# Altium schematic sheet interface.SchDoc (part 1 of 2)
size A1; SheetNumber: 1; SheetTotal: 1
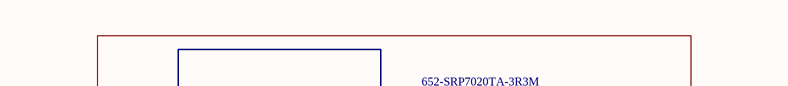
[diagram p0: interface.SchDoc, top left]
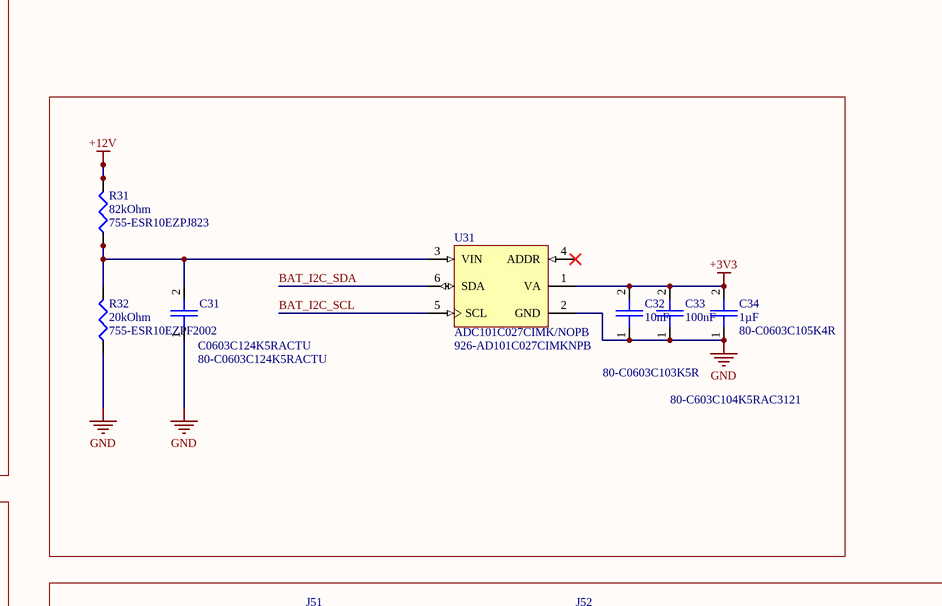
[diagram p1: interface.SchDoc, top right]
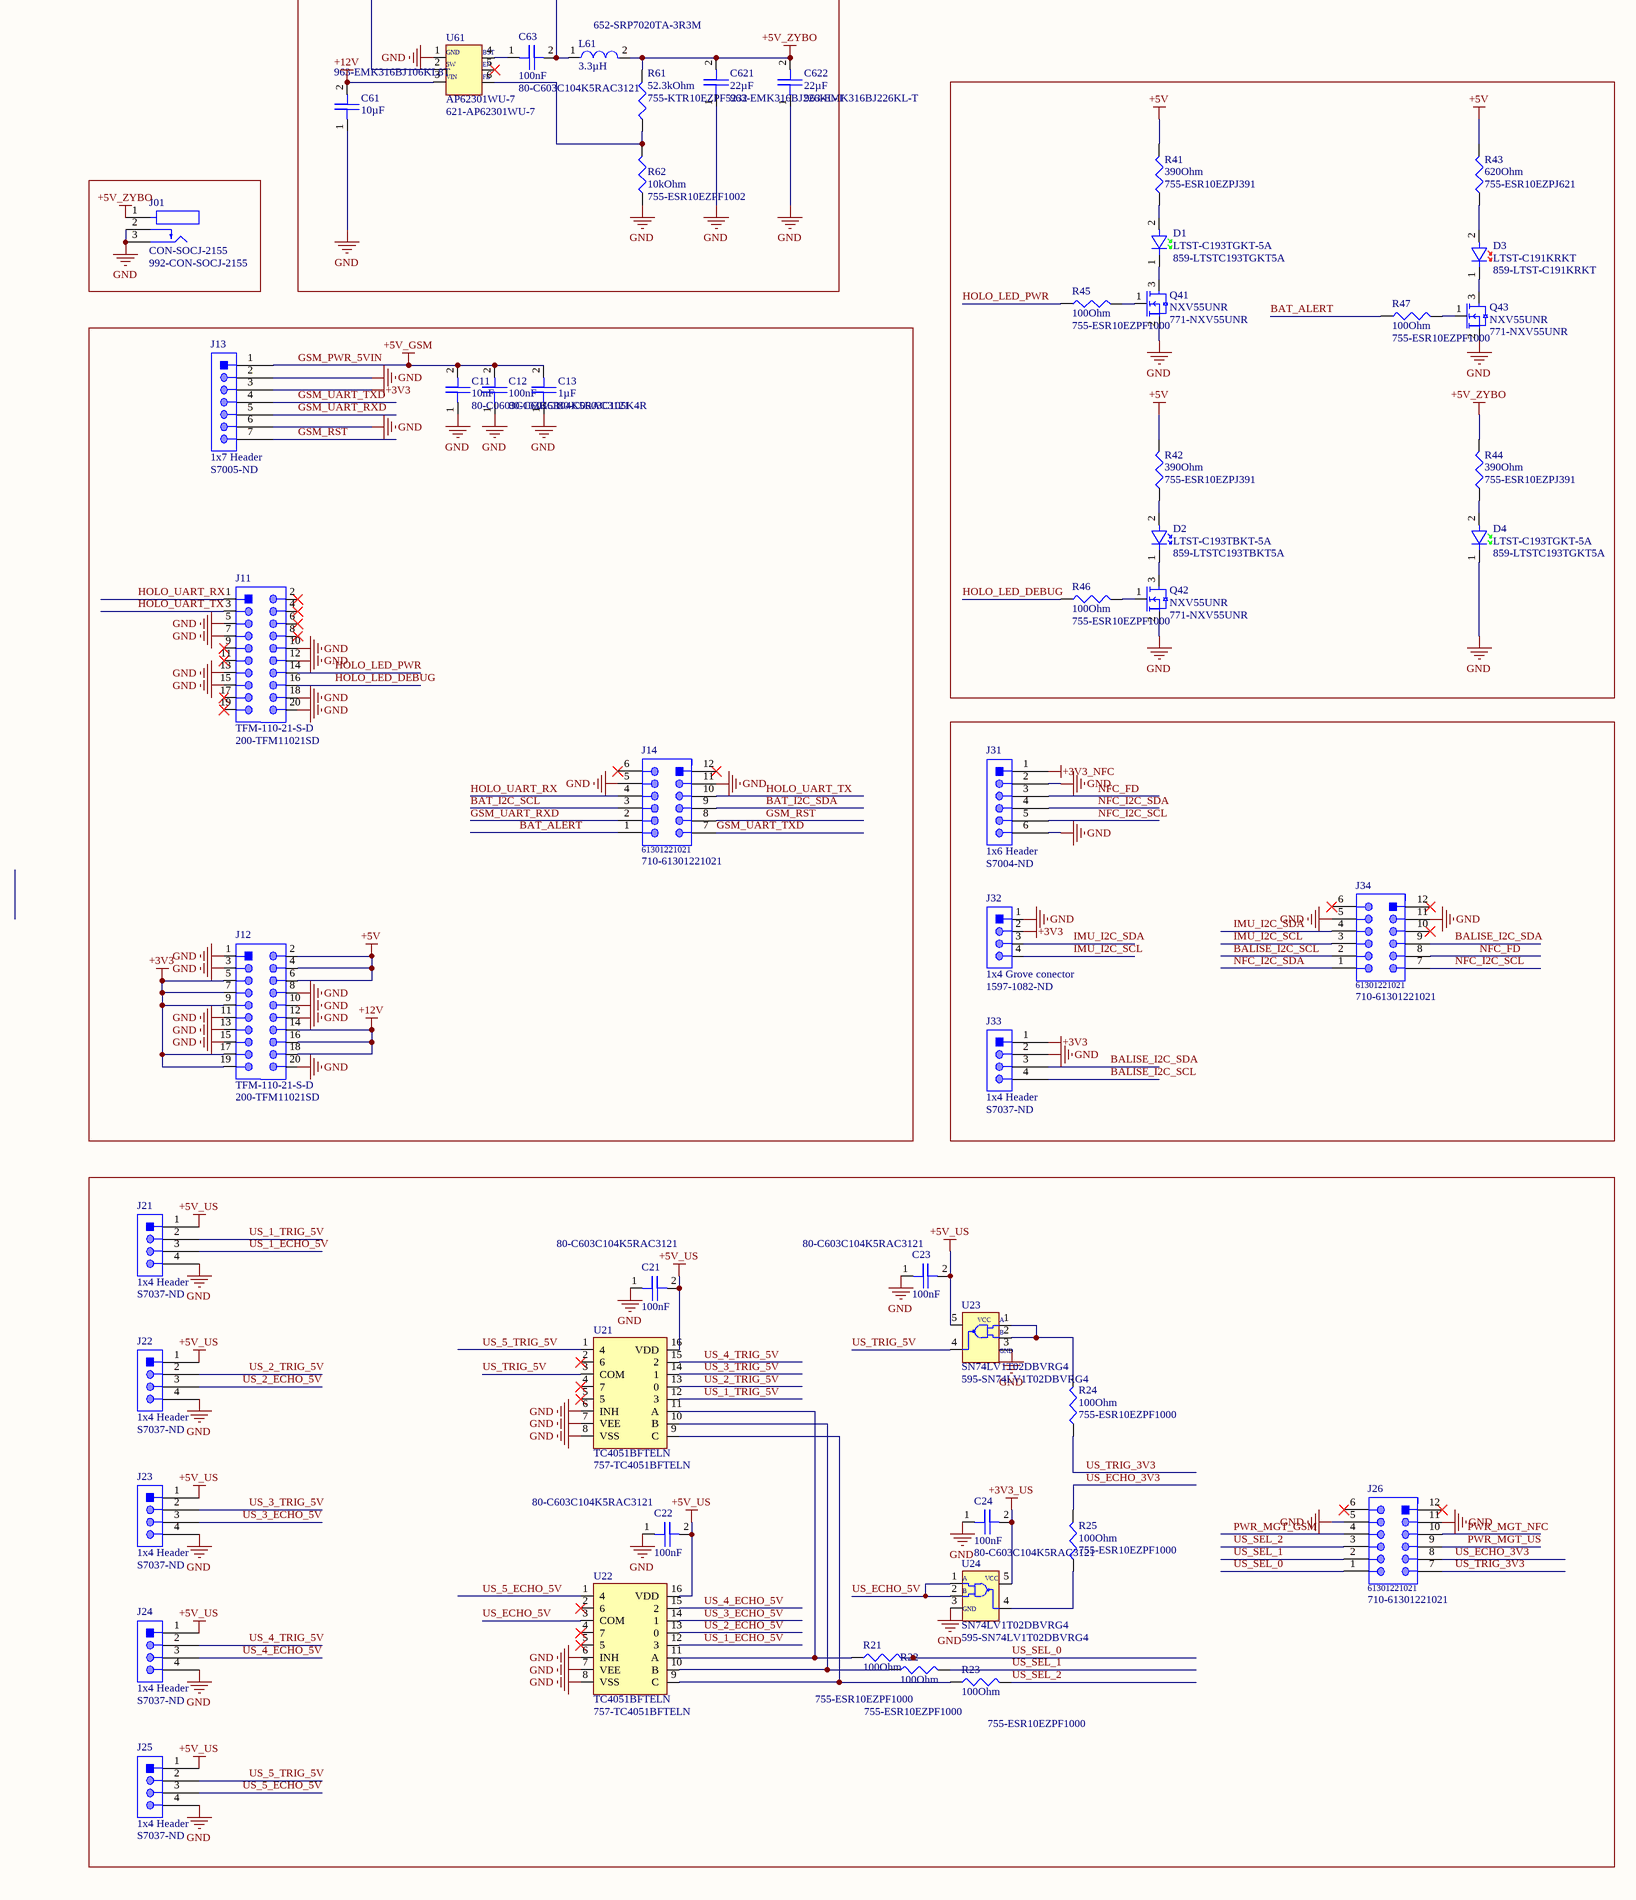
[diagram p2: interface.SchDoc, bottom left]
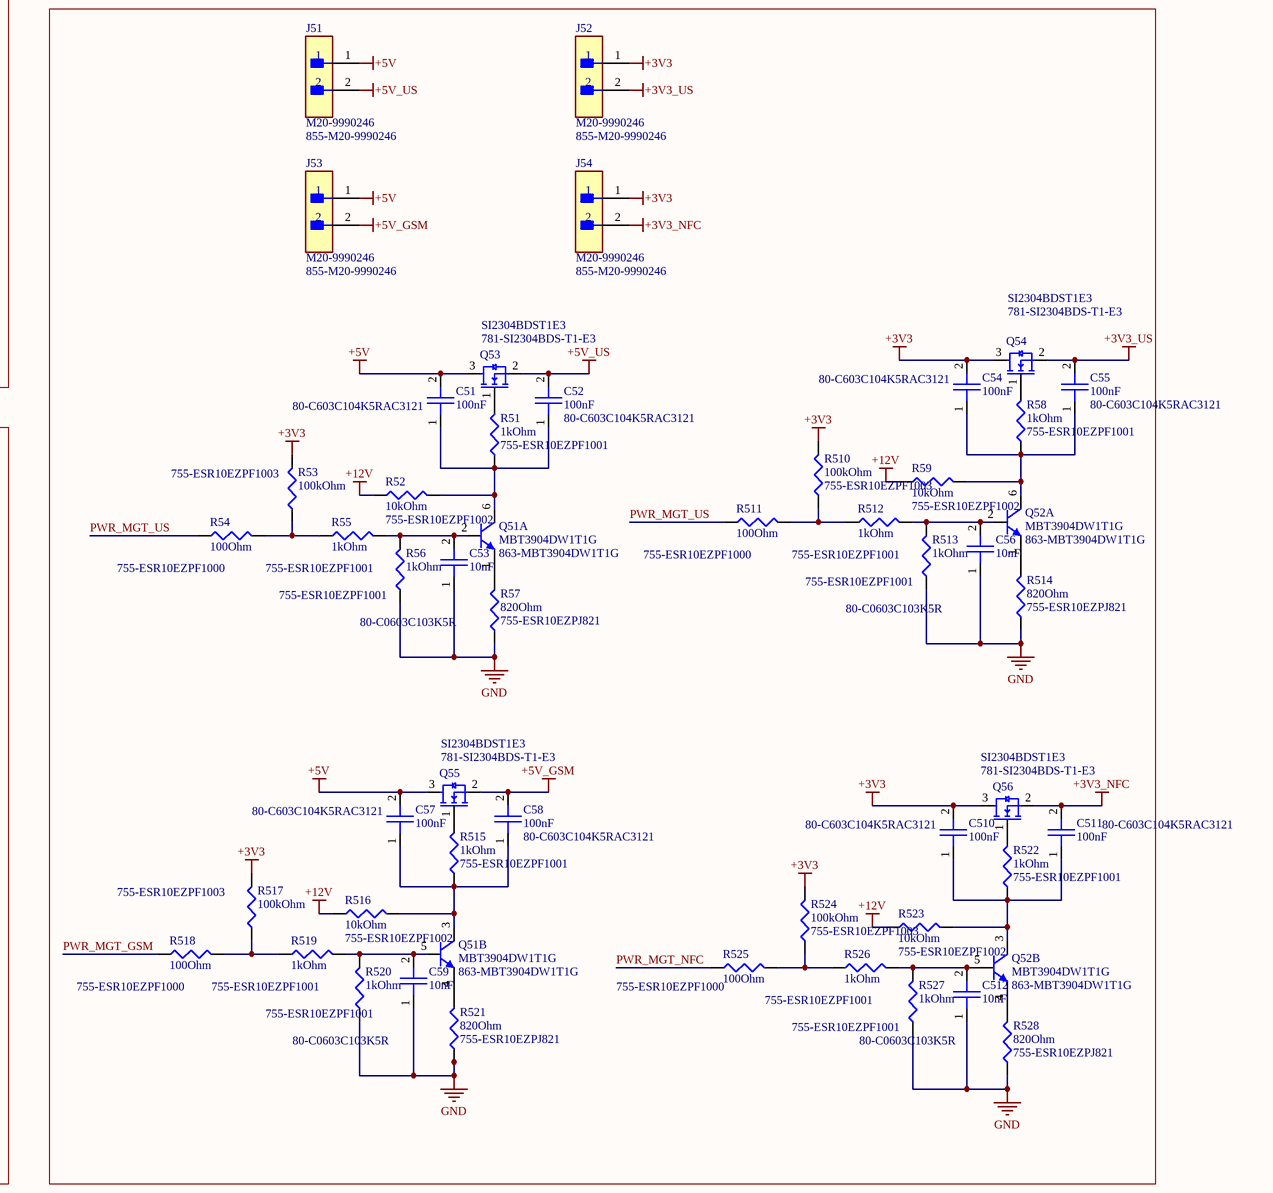
[diagram p3: interface.SchDoc, bottom right]

## Parts
C11  10nF  Supplier Part Number 1: 80-C0603C103K5R  [FP-C0603C-CF-IPC_A]
C12  100nF  Supplier Part Number 1: 80-C603C104K5RAC3121  [FP-C0603C104K5RAC3121-IPC_A]
C13  1µF  Supplier Part Number 1: 80-C0603C105K4R  [CAPC1608X90X35NL15T15]
C21  100nF  Supplier Part Number 1: 80-C603C104K5RAC3121  [FP-C0603C104K5RAC3121-IPC_A]
C22  100nF  Supplier Part Number 1: 80-C603C104K5RAC3121  [FP-C0603C104K5RAC3121-IPC_A]
C23  100nF  Supplier Part Number 1: 80-C603C104K5RAC3121  [FP-C0603C104K5RAC3121-IPC_A]
C24  100nF  Supplier Part Number 1: 80-C603C104K5RAC3121  [FP-C0603C104K5RAC3121-IPC_A]
C31  C0603C124K5RACTU  Supplier Part Number 1: 80-C0603C124K5RACTU  [FP-C0603C-CF-IPC_A]
C32  10nF  Supplier Part Number 1: 80-C0603C103K5R  [FP-C0603C-CF-IPC_A]
C33  100nF  Supplier Part Number 1: 80-C603C104K5RAC3121  [FP-C0603C104K5RAC3121-IPC_A]
C34  1µF  Supplier Part Number 1: 80-C0603C105K4R  [CAPC1608X90X35NL15T15]
C51  100nF  Supplier Part Number 1: 80-C603C104K5RAC3121  [FP-C0603C104K5RAC3121-IPC_A]
C52  100nF  Supplier Part Number 1: 80-C603C104K5RAC3121  [FP-C0603C104K5RAC3121-IPC_A]
C53  10nF  Supplier Part Number 1: 80-C0603C103K5R  [FP-C0603C-CF-IPC_A]
C54  100nF  Supplier Part Number 1: 80-C603C104K5RAC3121  [FP-C0603C104K5RAC3121-IPC_A]
C55  100nF  Supplier Part Number 1: 80-C603C104K5RAC3121  [FP-C0603C104K5RAC3121-IPC_A]
C56  10nF  Supplier Part Number 1: 80-C0603C103K5R  [FP-C0603C-CF-IPC_A]
C57  100nF  Supplier Part Number 1: 80-C603C104K5RAC3121  [FP-C0603C104K5RAC3121-IPC_A]
C58  100nF  Supplier Part Number 1: 80-C603C104K5RAC3121  [FP-C0603C104K5RAC3121-IPC_A]
C59  10nF  Supplier Part Number 1: 80-C0603C103K5R  [FP-C0603C-CF-IPC_A]
C61  10µF  Supplier Part Number 1: 963-EMK316BJ106KL8T  [FP-1206-L_3_2_0_15-W_1_6-IPC_A]
C63  100nF  Supplier Part Number 1: 80-C603C104K5RAC3121  [FP-C0603C104K5RAC3121-IPC_A]
C510  100nF  Supplier Part Number 1: 80-C603C104K5RAC3121  [FP-C0603C104K5RAC3121-IPC_A]
C511  100nF  Supplier Part Number 1: 80-C603C104K5RAC3121  [FP-C0603C104K5RAC3121-IPC_A]
C512  10nF  Supplier Part Number 1: 80-C0603C103K5R  [FP-C0603C-CF-IPC_A]
C621  22µF  Supplier Part Number 1: 963-EMK316BJ226KL-T  [CAPC3216X180N]
C622  22µF  Supplier Part Number 1: 963-EMK316BJ226KL-T  [CAPC3216X180N]
D1  LTST-C193TGKT-5A  Supplier Part Number 1: 859-LTSTC193TGKT5A  [FP-LTST-C193TGKT-5A]
D2  LTST-C193TBKT-5A  Supplier Part Number 1: 859-LTSTC193TBKT5A  [FP-LTST-C193TBKT-5A-MFG]
D3  LTST-C191KRKT  Supplier Part Number 1: 859-LTST-C191KRKT  [FP-LTST-C191KRKT]
D4  LTST-C193TGKT-5A  Supplier Part Number 1: 859-LTSTC193TGKT5A  [FP-LTST-C193TGKT-5A]
J01  CON-SOCJ-2155  Supplier Part Number 1: 992-CON-SOCJ-2155  [GRAVITECH_CON-SOCJ-2155]
J11  TFM-110-21-S-D  Supplier Part Number 1: 200-TFM11021SD  [SAMTEC_TFM-110-21-S-D]
J12  TFM-110-21-S-D  Supplier Part Number 1: 200-TFM11021SD  [SAMTEC_TFM-110-21-S-D]
J13  1x7 Header  Supplier Part Number 1: S7005-ND  [header 1x7]
J14  61301221021  Supplier Part Number 1: 710-61301221021  [61301221021]
J21  1x4 Header  Supplier Part Number 1: S7037-ND  [header 1x4]
J22  1x4 Header  Supplier Part Number 1: S7037-ND  [header 1x4]
J23  1x4 Header  Supplier Part Number 1: S7037-ND  [header 1x4]
J24  1x4 Header  Supplier Part Number 1: S7037-ND  [header 1x4]
J25  1x4 Header  Supplier Part Number 1: S7037-ND  [header 1x4]
J26  61301221021  Supplier Part Number 1: 710-61301221021  [61301221021]
J31  1x6 Header  Supplier Part Number 1: S7004-ND  [header 1x6]
J32  1x4 Grove conector  Supplier Part Number 1: 1597-1082-ND  [FP-110990030]
J33  1x4 Header  Supplier Part Number 1: S7037-ND  [header 1x4]
J34  61301221021  Supplier Part Number 1: 710-61301221021  [61301221021]
J51  M20-9990246  Supplier Part Number 1: 855-M20-9990246  [FP-M20-9990246-MFG]
J52  M20-9990246  Supplier Part Number 1: 855-M20-9990246  [FP-M20-9990246-MFG]
J53  M20-9990246  Supplier Part Number 1: 855-M20-9990246  [FP-M20-9990246-MFG]
J54  M20-9990246  Supplier Part Number 1: 855-M20-9990246  [FP-M20-9990246-MFG]
L61  3.3µH  Supplier Part Number 1: 652-SRP7020TA-3R3M  [INDC7066X20N]
Q41  NXV55UNR  Supplier Part Number 1: 771-NXV55UNR  [SOT95P230X110-3N]
Q42  NXV55UNR  Supplier Part Number 1: 771-NXV55UNR  [SOT95P230X110-3N]
Q43  NXV55UNR  Supplier Part Number 1: 771-NXV55UNR  [SOT95P230X110-3N]
Q51  MBT3904DW1T1G  Supplier Part Number 1: 863-MBT3904DW1T1G  [ONSC-SOT-363-6-419B-02_W_V]  (parts A,B of 2)
Q52  MBT3904DW1T1G  Supplier Part Number 1: 863-MBT3904DW1T1G  [ONSC-SOT-363-6-419B-02_W_V]  (parts A,B of 2)
Q53  SI2304BDST1E3  Supplier Part Number 1: 781-SI2304BDS-T1-E3  [FP-SI2304BDST1E3]
Q54  SI2304BDST1E3  Supplier Part Number 1: 781-SI2304BDS-T1-E3  [FP-SI2304BDST1E3]
Q55  SI2304BDST1E3  Supplier Part Number 1: 781-SI2304BDS-T1-E3  [FP-SI2304BDST1E3]
Q56  SI2304BDST1E3  Supplier Part Number 1: 781-SI2304BDS-T1-E3  [FP-SI2304BDST1E3]
R21  100Ohm  Supplier Part Number 1: 755-ESR10EZPF1000  [FP-ESR10-IPC_A]
R22  100Ohm  Supplier Part Number 1: 755-ESR10EZPF1000  [FP-ESR10-IPC_A]
R23  100Ohm  Supplier Part Number 1: 755-ESR10EZPF1000  [FP-ESR10-IPC_A]
R24  100Ohm  Supplier Part Number 1: 755-ESR10EZPF1000  [FP-ESR10-IPC_A]
R25  100Ohm  Supplier Part Number 1: 755-ESR10EZPF1000  [FP-ESR10-IPC_A]
R31  82kOhm  Supplier Part Number 1: 755-ESR10EZPJ823  [FP-ESR10-IPC_A]
R32  20kOhm  Supplier Part Number 1: 755-ESR10EZPF2002  [FP-ESR10-IPC_A]
R41  390Ohm  Supplier Part Number 1: 755-ESR10EZPJ391  [FP-ESR10-IPC_A]
R42  390Ohm  Supplier Part Number 1: 755-ESR10EZPJ391  [FP-ESR10-IPC_A]
R43  620Ohm  Supplier Part Number 1: 755-ESR10EZPJ621  [FP-ESR10-IPC_A]
R44  390Ohm  Supplier Part Number 1: 755-ESR10EZPJ391  [FP-ESR10-IPC_A]
R45  100Ohm  Supplier Part Number 1: 755-ESR10EZPF1000  [FP-ESR10-IPC_A]
R46  100Ohm  Supplier Part Number 1: 755-ESR10EZPF1000  [FP-ESR10-IPC_A]
R47  100Ohm  Supplier Part Number 1: 755-ESR10EZPF1000  [FP-ESR10-IPC_A]
R51  1kOhm  Supplier Part Number 1: 755-ESR10EZPF1001  [FP-ESR10-IPC_A]
R52  10kOhm  Supplier Part Number 1: 755-ESR10EZPF1002  [FP-ESR10-IPC_A]
R53  100kOhm  Supplier Part Number 1: 755-ESR10EZPF1003  [FP-ESR10-IPC_A]
R54  100Ohm  Supplier Part Number 1: 755-ESR10EZPF1000  [FP-ESR10-IPC_A]
R55  1kOhm  Supplier Part Number 1: 755-ESR10EZPF1001  [FP-ESR10-IPC_A]
R56  1kOhm  Supplier Part Number 1: 755-ESR10EZPF1001  [FP-ESR10-IPC_A]
R57  820Ohm  Supplier Part Number 1: 755-ESR10EZPJ821  [FP-ESR10-IPC_A]
R58  1kOhm  Supplier Part Number 1: 755-ESR10EZPF1001  [FP-ESR10-IPC_A]
R59  10kOhm  Supplier Part Number 1: 755-ESR10EZPF1002  [FP-ESR10-IPC_A]
R61  52.3kOhm  Supplier Part Number 1: 755-KTR10EZPF5232  [FP-KTR10-IPC_A]
R62  10kOhm  Supplier Part Number 1: 755-ESR10EZPF1002  [FP-ESR10-IPC_A]
R510  100kOhm  Supplier Part Number 1: 755-ESR10EZPF1003  [FP-ESR10-IPC_A]
R511  100Ohm  Supplier Part Number 1: 755-ESR10EZPF1000  [FP-ESR10-IPC_A]
R512  1kOhm  Supplier Part Number 1: 755-ESR10EZPF1001  [FP-ESR10-IPC_A]
R513  1kOhm  Supplier Part Number 1: 755-ESR10EZPF1001  [FP-ESR10-IPC_A]
R514  820Ohm  Supplier Part Number 1: 755-ESR10EZPJ821  [FP-ESR10-IPC_A]
R515  1kOhm  Supplier Part Number 1: 755-ESR10EZPF1001  [FP-ESR10-IPC_A]
R516  10kOhm  Supplier Part Number 1: 755-ESR10EZPF1002  [FP-ESR10-IPC_A]
R517  100kOhm  Supplier Part Number 1: 755-ESR10EZPF1003  [FP-ESR10-IPC_A]
R518  100Ohm  Supplier Part Number 1: 755-ESR10EZPF1000  [FP-ESR10-IPC_A]
R519  1kOhm  Supplier Part Number 1: 755-ESR10EZPF1001  [FP-ESR10-IPC_A]
R520  1kOhm  Supplier Part Number 1: 755-ESR10EZPF1001  [FP-ESR10-IPC_A]
R521  820Ohm  Supplier Part Number 1: 755-ESR10EZPJ821  [FP-ESR10-IPC_A]
R522  1kOhm  Supplier Part Number 1: 755-ESR10EZPF1001  [FP-ESR10-IPC_A]
R523  10kOhm  Supplier Part Number 1: 755-ESR10EZPF1002  [FP-ESR10-IPC_A]
R524  100kOhm  Supplier Part Number 1: 755-ESR10EZPF1003  [FP-ESR10-IPC_A]
R525  100Ohm  Supplier Part Number 1: 755-ESR10EZPF1000  [FP-ESR10-IPC_A]
R526  1kOhm  Supplier Part Number 1: 755-ESR10EZPF1001  [FP-ESR10-IPC_A]
R527  1kOhm  Supplier Part Number 1: 755-ESR10EZPF1001  [FP-ESR10-IPC_A]
R528  820Ohm  Supplier Part Number 1: 755-ESR10EZPJ821  [FP-ESR10-IPC_A]
U21  TC4051BFTELN  Supplier Part Number 1: 757-TC4051BFTELN  [FP-TC4051BFTELN]
U22  TC4051BFTELN  Supplier Part Number 1: 757-TC4051BFTELN  [FP-TC4051BFTELN]
U23  SN74LV1T02DBVRG4  Supplier Part Number 1: 595-SN74LV1T02DBVRG4  [FP-DBV0005A-IPC_A]
U24  SN74LV1T02DBVRG4  Supplier Part Number 1: 595-SN74LV1T02DBVRG4  [FP-DBV0005A-IPC_A]
U31  ADC101C027CIMK/NOPB  Supplier Part Number 1: 926-AD101C027CIMKNPB  [MK06A_N]
U61  AP62301WU-7  Supplier Part Number 1: 621-AP62301WU-7  [TSOP95P280X100-6N]

## Nets
+3V3: C32.2 C33.2 C34.2 C54.2 C510.2 J12.5 J12.7 J12.9 J12.17 J12.19 J13.3 J32.2 J33.1 J52.1 J54.1 Q54.3 Q56.3 R53.2 R510.2 R517.2 R524.2 U31.1(VA)
+3V3_NFC: C511.2 J31.1 J54.2 Q56.2
+3V3_US: C24.2 C55.2 J52.2 Q54.2 U24.5(VCC)
+5V: C51.2 C57.2 J12.2 J12.4 J12.6 J51.1 J53.1 Q53.3 Q55.3 R41.2 R42.2 R43.2
+5V_US: C21.2 C22.2 C23.2 C52.2 J21.1 J22.1 J23.1 J24.1 J25.1 J51.2 Q53.2 U21.16(VDD) U22.16(VDD) U23.5(VCC)
+5V_ZYBO: C621.2 C622.2 J01.1 L61.2 R44.2 R61.2
+12V: C61.2 J12.14 J12.16 J12.18 R31.2 R52.1 R59.1 R516.1 R523.1 U61.3
GND: C11.1 C12.1 C13.1 C21.1 C22.1 C23.1 C24.1 C31.1 C32.1 C33.1 C34.1 C53.1 C56.1 C59.1 C61.1 C512.1 C621.1 C622.1 D4.1 J01.2 J01.3 J11.5 J11.7 J11.10 J11.12 J11.13 J11.15 J11.18 J11.20 J12.1 J12.3 J12.8 J12.10 J12.11 J12.12 J12.13 J12.15 J12.20 J13.2 J13.6 J14.5 J14.11 J21.4 J22.4 J23.4 J24.4 J25.4 J26.5 J26.11 J31.2 J31.6 J32.1 J33.2 J34.5 J34.11 Q41.2 Q42.2 Q43.2 R32.1 R56.1 R57.1 R62.1 R513.1 R514.1 R520.1 R521.1 R527.1 R528.1 U21.6(INH) U21.7(VEE) U21.8(VSS) U22.6(INH) U22.7(VEE) U22.8(VSS) U23.3(GND) U24.3(GND) U31.2(GND) U61.1
GSM_PWR_5VIN: C11.2 C12.2 C13.2 C58.2 J13.1 J53.2 Q55.2  [also labelled +5V_GSM]
BALISE_I2C_SCL: J33.4 J34.2
BALISE_I2C_SDA: J33.3 J34.9
BAT_ALERT: J14.1 R47.1
BAT_I2C_SCL: J14.3 U31.5(SCL)
BAT_I2C_SDA: J14.9 U31.6(SDA)
GSM_RST: J13.7 J14.8
GSM_UART_RXD: J13.5 J14.2
GSM_UART_TXD: J13.4 J14.7
HOLO_LED_DEBUG: J11.16 R46.1
HOLO_LED_PWR: J11.14 R45.1
HOLO_UART_RX: J11.1 J14.4
HOLO_UART_TX: J11.3 J14.10
IMU_I2C_SCL: J32.4 J34.3
IMU_I2C_SDA: J32.3 J34.4
NFC_FD: J31.3 J34.8
NFC_I2C_SCL: J31.5 J34.7
NFC_I2C_SDA: J31.4 J34.1
PWR_MGT_GSM: J26.4 R518.1
PWR_MGT_NFC: J26.10 R525.1
PWR_MGT_US: J26.9 R54.1 R511.1
US_1_ECHO_5V: J21.3 U22.12(3)
US_1_TRIG_5V: J21.2 U21.12(3)
US_2_ECHO_5V: J22.3 U22.13(0)
US_2_TRIG_5V: J22.2 U21.13(0)
US_3_ECHO_5V: J23.3 U22.14(1)
US_3_TRIG_5V: J23.2 U21.14(1)
US_4_ECHO_5V: J24.3 U22.15(2)
US_4_TRIG_5V: J24.2 U21.15(2)
US_5_ECHO_5V: J25.3 U22.1(4)
US_5_TRIG_5V: J25.2 U21.1(4)
US_ECHO_3V3: J26.8 R25.2
US_ECHO_5V: U22.3(COM) U24.1 U24.2
US_SEL_0: J26.1 R21.2
US_SEL_1: J26.2 R22.2
US_SEL_2: J26.3 R23.2
US_TRIG_3V3: J26.7 R24.1
US_TRIG_5V: U21.3(COM) U23.4
NetC31_2: C31.2 R31.1 R32.2 U31.3(VIN)
NetC51_1: C51.1 C52.1 Q51.6(C) R51.1 R52.2
NetC53_2: C53.2 Q51.2(B) R55.2 R56.2
NetC54_1: C54.1 C55.1 Q52.6(C) R58.1 R59.2
NetC56_2: C56.2 Q52.2(B) R512.2 R513.2
NetC57_1: C57.1 C58.1 Q51.3(C) R515.1 R516.2
NetC59_2: C59.2 Q51.5(B) R519.2 R520.2
NetC63_1: C63.1 U61.4
NetC63_2: C63.2 L61.1 U61.2
NetC510_1: C510.1 C511.1 Q52.3(C) R522.1 R523.2
NetC512_2: C512.2 Q52.5(B) R526.2 R527.2
NetD1_1: D1.1 Q41.3
NetD1_2: D1.2 R41.1
NetD2_1: D2.1 Q42.3
NetD2_2: D2.2 R42.1
NetD3_1: D3.1 Q43.3
NetD3_2: D3.2 R43.1
NetD4_2: D4.2 R44.1
NetQ41_1: Q41.1 R45.2
NetQ42_1: Q42.1 R46.2
NetQ43_1: Q43.1 R47.2
NetQ51_1: Q51.1(E) R57.2
NetQ51_4: Q51.4(E) R521.2
NetQ52_1: Q52.1(E) R514.2
NetQ52_4: Q52.4(E) R528.2
NetQ53_1: Q53.1 R51.2
NetQ54_1: Q54.1 R58.2
NetQ55_1: Q55.1 R515.2
NetQ56_1: Q56.1 R522.2
NetR21_1: R21.1 U21.11(A) U22.11(A)
NetR22_1: R22.1 U21.10(B) U22.10(B)
NetR23_1: R23.1 U21.9(C) U22.9(C)
NetR24_2: R24.2 U23.1 U23.2
NetR25_1: R25.1 U24.4
NetR53_1: R53.1 R54.2 R55.1
NetR61_1: R61.1 R62.2 U61.6
NetR510_1: R510.1 R511.2 R512.1
NetR517_1: R517.1 R518.2 R519.1
NetR524_1: R524.1 R525.2 R526.1

Not connected (* = marked no-connect by the designer): J11 2* 4* 6* 8* 9* 11* 17* 19*; J14 6* 12*; J26 6* 12*; J34 6* 10* 12*; U21 2(6)* 4(7)* 5*; U22 2(6)* 4(7)* 5*; U31 4(ADDR)*; U61 5*